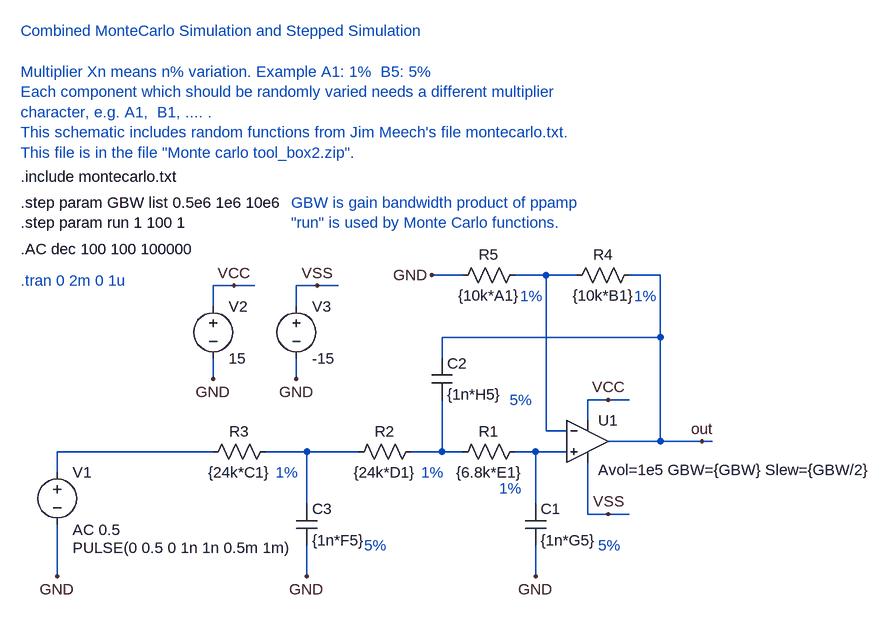
[diagram p0: schematic butter3_lp10k_mc.asc]
butter3_lp10k_mc.asc, the LTspice schematic file:
Version 4
SHEET 1 2032 1492
WIRE 1520 928 1472 928
WIRE 1344 928 1296 928
WIRE 1600 928 1648 928
WIRE 1648 928 1648 1024
WIRE 1648 1184 1568 1184
WIRE 1504 1200 1456 1200
WIRE 1344 1200 1312 1200
WIRE 1184 1200 1104 1200
WIRE 1504 1168 1472 1168
WIRE 1472 1168 1472 928
WIRE 1472 928 1424 928
WIRE 1312 1056 1312 1024
WIRE 1312 1024 1648 1024
WIRE 1648 1024 1648 1184
WIRE 1312 1120 1312 1200
WIRE 1312 1200 1264 1200
WIRE 1456 1280 1456 1200
WIRE 1456 1200 1424 1200
WIRE 1456 1344 1456 1392
WIRE 960 1200 720 1200
WIRE 720 1200 720 1232
WIRE 720 1312 720 1392
WIRE 1648 1184 1712 1184
WIRE 1712 1184 1728 1184
WIRE 1536 1152 1536 1120
WIRE 1536 1120 1568 1120
WIRE 1536 1216 1536 1296
WIRE 1568 1120 1600 1120
WIRE 1536 1296 1568 1296
WIRE 1568 1296 1600 1296
WIRE 1088 976 1088 944
WIRE 1088 944 1120 944
WIRE 960 976 960 944
WIRE 960 944 992 944
WIRE 992 944 1024 944
WIRE 1120 944 1152 944
WIRE 1088 1056 1088 1088
WIRE 960 1056 960 1088
WIRE 1104 1280 1104 1200
WIRE 1104 1200 1040 1200
WIRE 1104 1344 1104 1392
FLAG 1296 928 GND
FLAG 1456 1392 GND
FLAG 720 1392 GND
FLAG 1712 1184 out
FLAG 1568 1120 VCC
FLAG 1568 1296 VSS
FLAG 992 944 VCC
FLAG 1120 944 VSS
FLAG 1088 1088 GND
FLAG 960 1088 GND
FLAG 1104 1392 GND
SYMBOL res 1328 1216 R270
WINDOW 0 32 56 VTop 0
WINDOW 3 0 56 VBottom 0
SYMATTR InstName R1
SYMATTR Value {6.8k*E1}
SYMBOL res 1168 1216 R270
WINDOW 0 32 56 VTop 0
WINDOW 3 0 56 VBottom 0
SYMATTR InstName R2
SYMATTR Value {24k*D1}
SYMBOL res 944 1216 R270
WINDOW 0 32 56 VTop 0
WINDOW 3 0 56 VBottom 0
SYMATTR InstName R3
SYMATTR Value {24k*C1}
SYMBOL res 1504 944 R270
WINDOW 0 32 56 VTop 0
WINDOW 3 0 56 VBottom 0
SYMATTR InstName R4
SYMATTR Value {10k*B1}
SYMBOL res 1328 944 R270
WINDOW 0 32 56 VTop 0
WINDOW 3 0 56 VBottom 0
SYMATTR InstName R5
SYMATTR Value {10k*A1}
SYMBOL cap 1440 1280 R0
SYMATTR InstName C1
SYMATTR Value {1n*G5}
SYMBOL cap 1296 1056 R0
SYMATTR InstName C2
SYMATTR Value {1n*H5}
SYMBOL voltage 720 1216 R0
WINDOW 3 24 132 Left 0
WINDOW 39 0 0 Left 0
WINDOW 123 24 104 Left 0
SYMATTR Value PULSE(0 0.5 0 1n 1n 0.5m 1m)
SYMATTR Value2 AC 0.5
SYMATTR InstName V1
SYMBOL voltage 960 960 R0
WINDOW 39 0 0 Left 0
WINDOW 123 0 0 Left 0
SYMATTR InstName V2
SYMATTR Value 15
SYMBOL voltage 1088 960 R0
WINDOW 39 0 0 Left 0
WINDOW 123 0 0 Left 0
SYMATTR InstName V3
SYMATTR Value -15
SYMBOL cap 1088 1280 R0
SYMATTR InstName C3
SYMATTR Value {1n*F5}
SYMBOL Opamps\\UniversalOpamp 1536 1184 R0
WINDOW 123 16 44 Left 0
SYMATTR Value2 Avol=1e5 GBW={GBW} Slew={GBW/2}
SYMATTR InstName U1
SYMATTR SpiceModel level3a
TEXT 664 888 Left 0 !.AC dec 100 100 100000
TEXT 664 936 Left 0 ;.tran 0 2m 0 1u
TEXT 664 816 Left 0 !.step param GBW list 0.5e6 1e6 10e6\n.step param run 1 100 1
TEXT 664 776 Left 0 !.include montecarlo.txt
TEXT 664 552 Left 0 ;Combined MonteCarlo Simulation and Stepped Simulation\n \nMultiplier Xn means n% variation. Example A1: 1%  B5: 5%\nEach component which should be randomly varied needs a different multiplier\ncharacter, e.g. A1,  B1, .... .\nThis schematic includes random functions from Jim Meech's file montecarlo.txt.\nThis file is in the file "Monte carlo tool_box2.zip".
TEXT 1552 1344 Left 0 ;5%
TEXT 1192 1344 Left 0 ;5%
TEXT 1416 1120 Left 0 ;5%
TEXT 1432 960 Left 0 ;1%
TEXT 1608 960 Left 0 ;1%
TEXT 1056 1232 Left 0 ;1%
TEXT 1280 1232 Left 0 ;1%
TEXT 1400 1256 Left 0 ;1%
TEXT 1080 816 Left 0 ;GBW is gain bandwidth product of ppamp \n"run" is used by Monte Carlo functions.

The netlist it stands for:
* butter3_lp10k_mc.asc
R1 N003 N002 {6.8k*E1}
R2 N004 N003 {24k*D1}
R3 N005 N004 {24k*C1}
R4 N001 out {10k*B1}
R5 GND N001 {10k*A1}
C1 N002 GND {1n*G5}
C2 out N003 {1n*H5}
V1 N005 GND PULSE(0 0.5 0 1n 1n 0.5m 1m) AC 0.5
V2 VCC GND 15
V3 VSS GND -15
C3 N004 GND {1n*F5}
XU1 N002 N001 VCC VSS out level3a Avol=1e5 GBW={GBW} Slew={GBW/2} En=0 Enk=0 In=0 Ink=0 Rin=500Meg  ; pins In+ In- V+ V- OUT
.AC dec 100 100 100000
* .tran 0 2m 0 1u
.step param GBW list 0.5e6 1e6 10e6
.step param run 1 100 1
.include montecarlo.txt
* Combined MonteCarlo Simulation and Stepped Simulation
* Multiplier Xn means n% variation. Example A1: 1%  B5: 5%
* Each component which should be randomly varied needs a different multiplier
* character, e.g. A1,  B1, .... .
* This schematic includes random functions from Jim Meech's file montecarlo.txt.
* This file is in the file "Monte carlo tool_box2.zip".
* 5%
* 5%
* 5%
* 1%
* 1%
* 1%
* 1%
* 1%
* GBW is gain bandwidth product of ppamp
* "run" is used by Monte Carlo functions.
.lib UniversalOpAmp1.lib
.backanno
.end